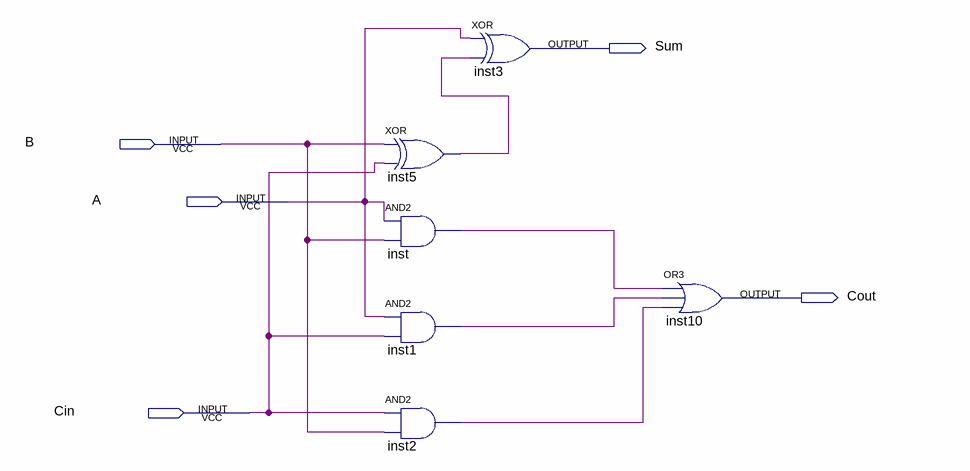
[diagram p0: schematic sheet]
// Quartus schematic Block1.bdf as structural Verilog: 6 symbols, 5 pins
module Block1 (
  input  B,
  input  A,
  input  Cin,
  output Sum,
  output Cout
);

  wire inst1_out, inst2_out, inst5_out, inst_out;

  xor inst5 (inst5_out, B, Cin);
  and inst (inst_out, A, B);
  and inst1 (inst1_out, A, Cin);
  and inst2 (inst2_out, Cin, B);
  xor inst3 (Sum, A, inst5_out);
  or inst10 (Cout, inst_out, inst1_out, inst2_out);
endmodule
